# EAGLE design MCP4726_bord (EAGLE 7.3.0)
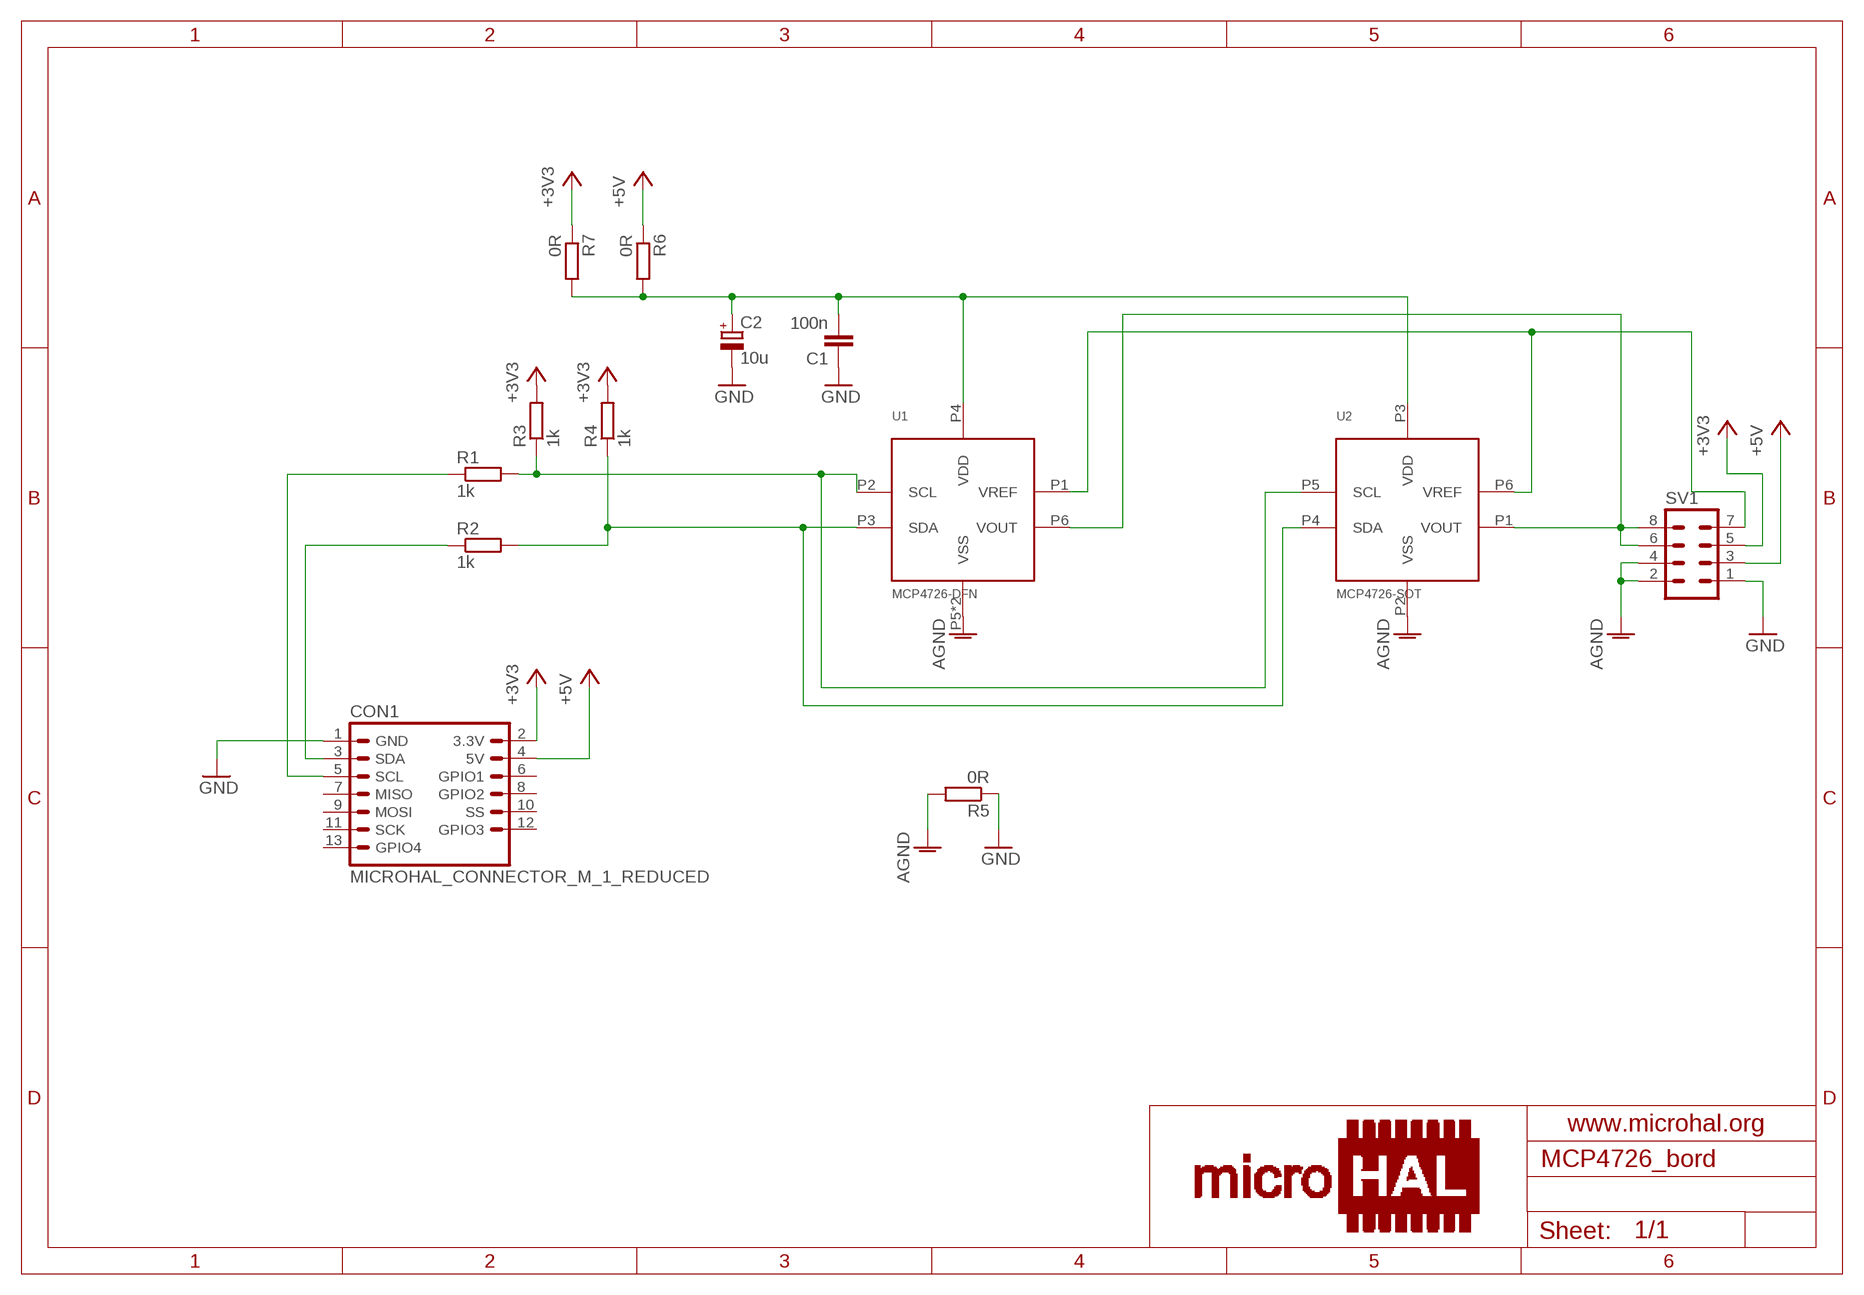
[diagram p0: schematic, sheet 1]

## Parts
C1  100n  C-EUC0603  [C0603]
C2  10u  CPOL-EU140CLH-0810  [140CLH-0810]
CON1  MICROHAL_CONNECTOR_M_1_REDUCED  [MICROHAL_CONNECTOR_M_1_REDUCED_EDGE]
R1  1k  R-EU_R0603  [R0603]
R2  1k  R-EU_R0603  [R0603]
R3  1k  R-EU_R0603  [R0603]
R4  1k  R-EU_R0603  [R0603]
R5  0R  R-EU_R0603  [R0603]
R6  0R  R-EU_R0603  [R0603]
R7  0R  R-EU_R0603  [R0603]
SV1  MA04-2  [MA04-2]
U1  MCP4726-DFN  [DFN-6]
U2  MCP4726-SOT  [SOT-23-6]

## Nets
+3V3: CON1.2(3.3V) R3.2 R4.2 R7.1 SV1.5
+5V: CON1.4(5V) R6.1 SV1.3
AGND: R5.2 SV1.2 SV1.4 U1.P5(VSS) U1.PAD(VSS) U2.P2(VSS)
GND: C1.1 C2.- CON1.1(GND) R5.1 SV1.1
N$1: CON1.3(SDA) R2.1
N$2: R2.2 R4.1 U1.P3(SDA) U2.P4(SDA)
N$3: CON1.5(SCL) R1.1
N$4: R1.2 R3.1 U1.P2(SCL) U2.P5(SCL)
N$5: SV1.6 SV1.8 U1.P6(VOUT) U2.P1(VOUT)
N$8: C1.2 C2.+ R6.2 R7.2 U1.P4(VDD) U2.P3(VDD)
N$9: SV1.7 U1.P1(VREF) U2.P6(VREF)
Unconnected: CON1.6(GPIO1) CON1.7(MISO) CON1.8(GPIO2) CON1.9(MOSI) CON1.10(SS) CON1.11(SCK) CON1.12(GPIO3) CON1.13(GPIO4)

## Library data of the parts
C1 = rcl:C-EU: CAPACITOR, European symbol
C2 = rcl:CPOL-EU: POLARIZED CAPACITOR, European symbol
CON1 = microhal-connector_v0.1:MICROHAL_CONNECTOR_M_1_REDUCED
R1-R7 = rcl:R-EU_: RESISTOR, European symbol
SV1 = con-lstb:MA04-2: PIN HEADER; OC_FARNELL: unknown; OC_NEWARK: unknown
U1 = MCP4726:MCP4726-DFN
U2 = MCP4726:MCP4726-SOT

## Board
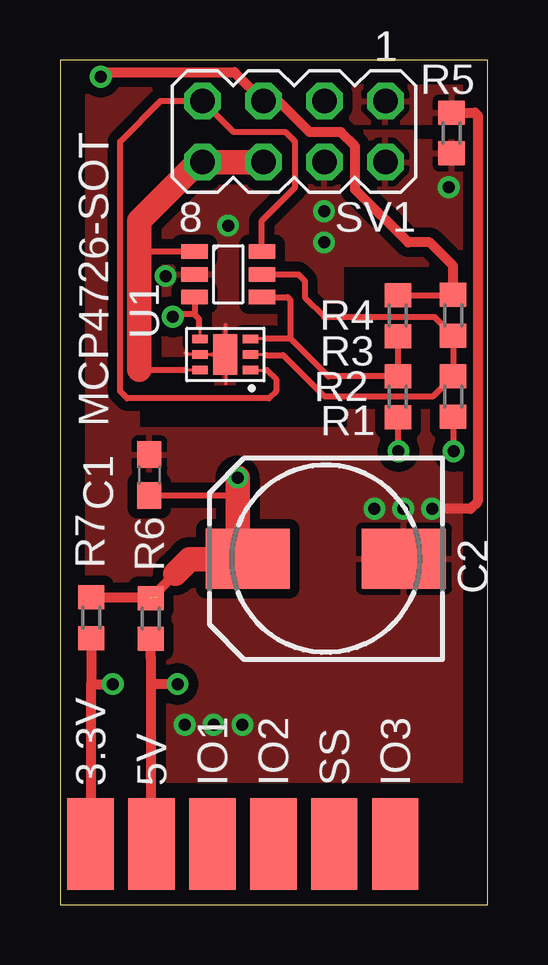
[diagram p1: board, top side]
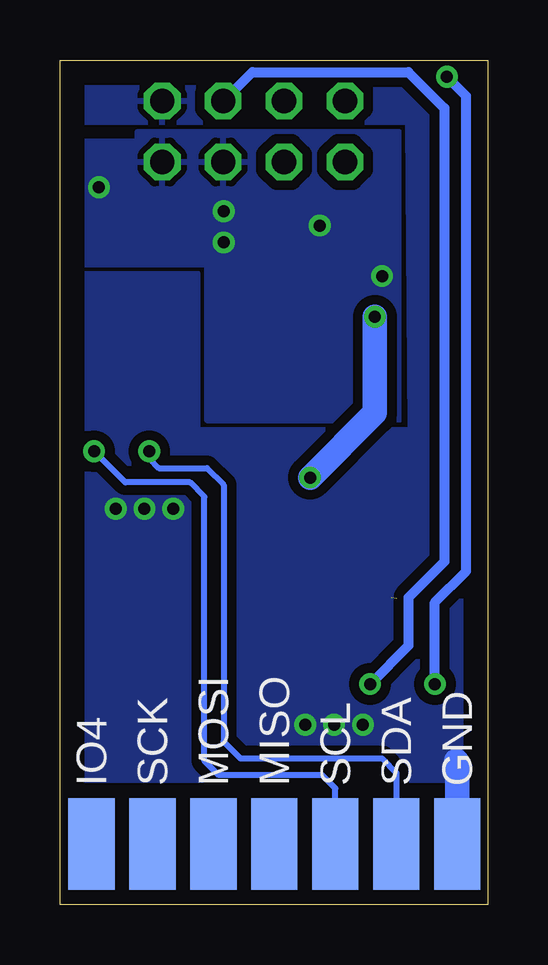
[diagram p2: board, bottom side, seen from below]

Size 17.82 x 35.2 mm. Coordinates in mm from the lower left corner, seen from the top.
Outline: 0,0 17.82,0 17.82,35.2 0,35.2 0,0
Copper layers (1*16): Top 0.035mm / dielectric 1.5mm / Bottom 0.035mm
Design rules "default": minimum track width 10mil, minimum drill 24mil, track to track 8mil, track to pad 8mil, pad to pad 8mil, via to via 8mil, smd to smd 8mil, copper to edge 40mil, drill to drill 8mil, minimum pad ring 10mil, minimum via ring 8mil, stop-mask expansion 4mil, vias tented up to drill 0mil, thermal gap 10mil

### Footprints (pad centres in the part's own frame; a part is rotated, then mirrored left to right if it is on the bottom)
C0603 = smd 1.1 x 1: 1 -0.85,0; 2 0.85,0
140CLH-0810 = smd 3.5 x 2.5: + 3.25,0; - -3.25,0
MICROHAL_CONNECTOR_M_1_REDUCED_EDGE = smd 1.93 x 3.81 bottom: 1 -7.62,0; 3 -5.08,0; 5 -2.54,0; 7 0,0; 9 2.54,0; 11 5.08,0; 13 7.62,0 | smd 1.93 x 3.81: 2 -7.62,0; 4 -5.08,0; 6 -2.54,0; 8 0,0; 10 2.54,0; 12 5.08,0
R0603 = smd 1 x 1.1: 1 -0.85,0; 2 0.85,0
MA04-2 = drill 1.016 octagon: 1 -3.81,-1.27; 2 -3.81,1.27; 3 -1.27,-1.27; 4 -1.27,1.27; 5 1.27,-1.27; 6 1.27,1.27; 7 3.81,-1.27; 8 3.81,1.27
DFN-6 = smd 0.65 x 0.35: P1 -1.05,0.65; P2 -1.05,0; P3 -1.05,-0.65; P4 1.05,-0.65; P5 1.05,0; P6 1.05,0.65 | smd 1 x 1.7: PAD 0,0
SOT-23-6 = smd 1.1 x 0.6: P1 -1.4,0.95; P2 -1.4,0; P3 -1.4,-0.95; P4 1.4,-0.95; P5 1.4,0; P6 1.4,0.95

### Placement (x,y rotation side)
C1  3.72,17.91 270 top
C2  11.08,14.42 180 top
CON1  8.89,2.54 0 top
R1  16.38,21.18 90 top
R2  14.08,21.17 90 top
R3  16.38,24.56 90 top
R4  14.08,24.55 90 top
R5  16.32,32.16 270 top
R6  3.78,11.93 90 top
R7  1.3,11.96 90 top
SV1  9.75,32.22 180 top
U1  6.89,22.93 180 top
U2  7.01,26.27 0 top

### Tracks (layer width: path | path; a pad name or v marks a point on that pad's centre or on a via)
+3V3  (via drill 0.5)
  Top 0.254: R4.2 R3.2
  Top 0.406: CON1.2 1.3,2.54 1.3,9.2 | R3.2 16.38,26.62 15.4,27.6 14.5,27.6 12.3,29.8 12.3,31.6 11.7,32.2 10.4,32.2 9.1,33.5 SV1.5 7.27,34.7 1.9,34.7 v1.7,34.5 | R7.1 1.3,9.2 | 1.3,9.2 v2.2,9.2
  Bottom 0.406: v2.2,9.2 2.2,12.6 0.9,13.9 0.9,33.7 v1.7,34.5
+5V  (via drill 0.5)
  Top 0.406: CON1.4 3.8,9.1 | 3.8,9.1 3.8,10.3 3.78,10.3 R6.1 | v4.9,9.2 3.9,9.2 3.8,9.1
  Bottom 0.406: SV1.3 9.8,34.7 3.3,34.7 1.8,33.2 1.8,14.3 3.3,12.8 3.3,10.8 v4.9,9.2
AGND  (via drill 0.5)
  Top 0.128: 5.2,23 5.27,22.93 U1.P5 U1.PAD 6.89,24.19 6.9,24.2 6.9,21.7
  other vias: 16.2,29.9 11,28.9 11,27.6 4.4,26.2 7,28.3
  pour Top (isolate 0.406): 3.7,32.2 14.6,32.2 14.6,31.8 17.3,31.8 17.3,26.7 11.7,26.7 11.7,20.2 3.7,20.2
  pour Bottom (isolate 0.406): 3.7,32.2 14.6,32.2 14.6,31.8 17.3,31.8 17.3,26.7 11.7,26.7 11.7,20.2 3.7,20.2
GND  (via drill 0.5)
  Top 0.406: R5.1 17.29,33.01 17.4,32.9 17.4,16.8 17.1,16.5 v15.5,16.5
  Bottom 1.016: CON1.1 1.27,5.97 1.3,6
  other vias: 7.6,7.5 6.4,7.5 5.2,7.5 13.1,16.5 14.3,16.5
  pour Top (isolate 0.406): 0,35.2 17.8,35.2 17.8,32.6 3.3,32.6 3.2,19.8 12.1,19.8 12.1,26.3 17.8,26.3 17.8,5.2 0,5.2
  pour Bottom (isolate 0.406): 3.3,32.6 17.8,32.6 17.8,35.2 0,35.2 0,5.2 17.8,5.2 17.8,26.3 12.1,26.3 12.1,19.8 3.2,19.8
N$1  (via drill 0.5)
  Top 0.254: R2.1 14.08,18.92 v14.1,18.9
  Bottom 0.254: v14.1,18.9 14.1,18.6 13.7,18.2 11.7,18.2 11,17.5 11,6.8 10.3,6.1 4.4,6.1 3.8,5.5 CON1.3
N$2
  Top 0.128: 7.96,23.6 8.6,23.6
  Top 0.254: R4.1 R2.2 11.18,22.02 9.6,23.6 | 7.96,23.6 U1.P3 | 8.6,23.6 9.6,23.6 | U2.P4 9.48,25.32 9.6,25.2 9.6,23.6
N$3  (via drill 0.5)
  Top 0.254: R1.1 16.38,19.2 | 16.38,19.2 16.38,18.92 v16.4,18.9 16.38,19.2
  Bottom 0.254: CON1.5 6.35,4.85 6.9,5.4 11.2,5.4 11.8,6 11.8,17 12.4,17.6 15.1,17.6 v16.4,18.9
N$4
  Top 0.128: U1.P2 8.57,22.93 8.6,22.9
  Top 0.254: R1.2 R3.1 15.59,24.5 11,24.5 10.2,25.3 10.2,26 9.93,26.27 U2.P5 | R1.2 16.43,22.03 16.5,22.1 | 8.6,22.9 9.3,22.9 11,21.2 15.55,21.2 R1.2
N$5
  Top 0.128: 5.2,22.3 5.82,22.3 U1.P6
  Top 0.254: SV1.6 SV1.8 5.9,31 | 3.3,22.3 5.2,22.3 | U2.P1 3.82,27.22 3.3,27.1
  Top 1.016: SV1.8 SV1.6 | 5.9,31 5.8,31 3.3,28.5 3.3,27.1 3.3,22.3
N$8  (via drill 0.5)  (1 unrouted)
  Top 0.128: U1.P4 5.84,24.06 5.8,24.1
  Top 0.254: U2.P3 5.61,24.61 5.6,24.6 | 5.6,24.6 4.8,24.6 v4.7,24.5 | C1.2 7.24,17.06 7.4,16.9 | 5.8,24.1 5.8,24.4 5.6,24.6
  Top 0.406: R7.2 4.01,12.81 4.01,13.01 4.8,13.8
  Top 1.016: 4.8,13.8 5.4,14.4 7.81,14.4 C2.+ 7.4,14.85 7.4,16.9 v7.4,17.8
  Bottom 1.016: v4.7,24.5 4.7,20.5 v7.4,17.8
N$9
  Top 0.128: U1.P1 8.62,22.28
  Top 0.254: 8.62,22.28 9,21.9 9,21.4 8.7,21.1 2.8,21.1 2.5,21.4 2.5,31.8 4.2,33.5 SV1.7 7.23,32.2 9.4,32.2 9.8,31.8 9.8,29.9 8.41,28.51 U2.P6